# EAGLE design Interconnect_board_v1p10 (EAGLE 9.3.1)
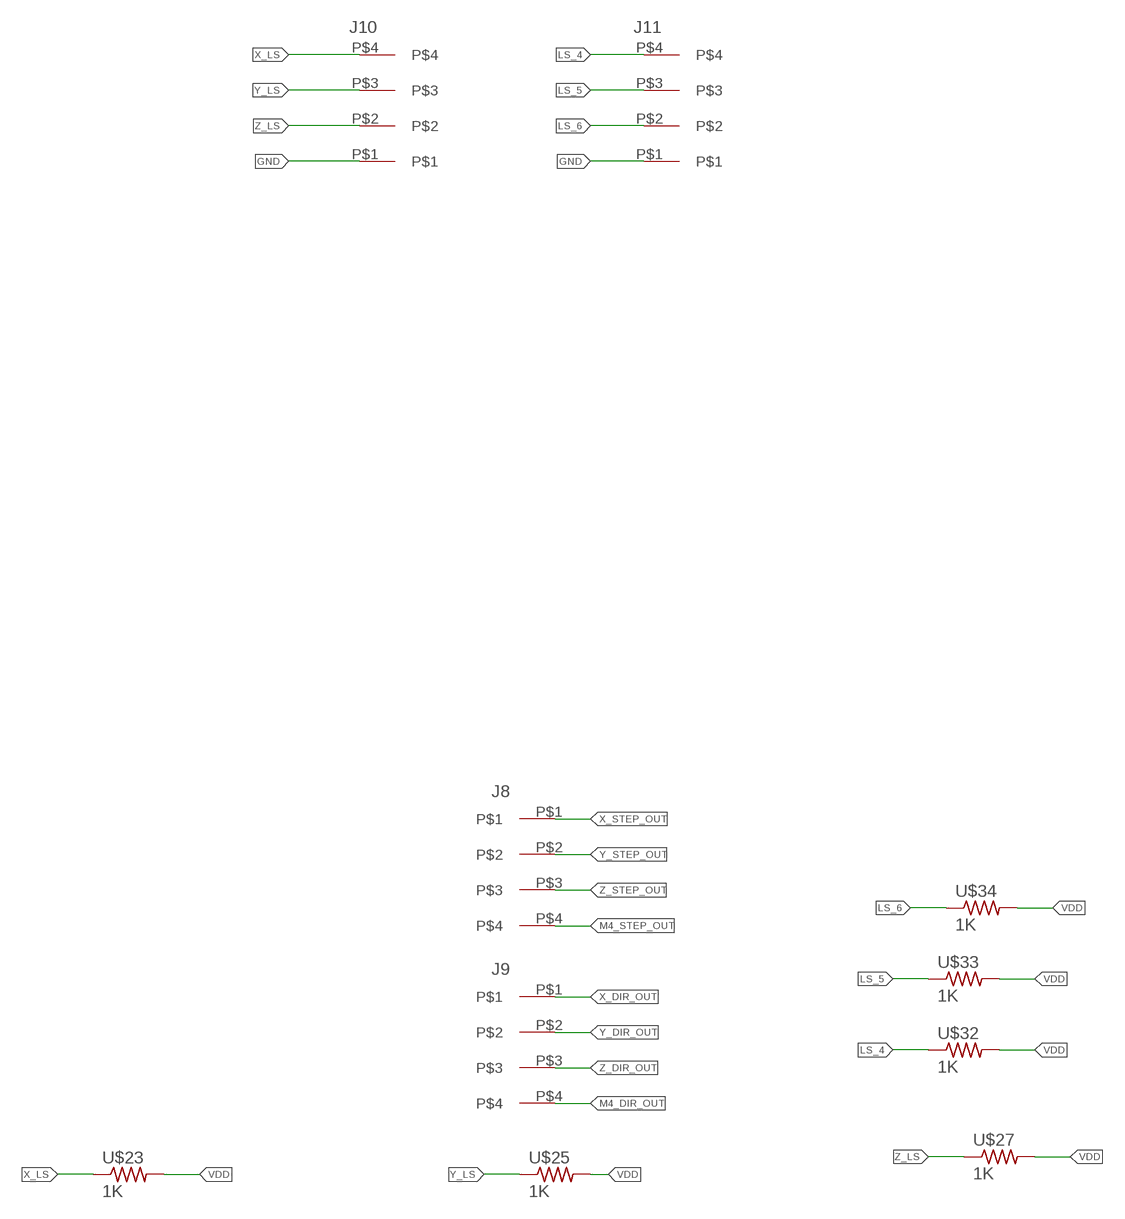
[diagram p0: schematic, sheet 1, part 1 of 2]
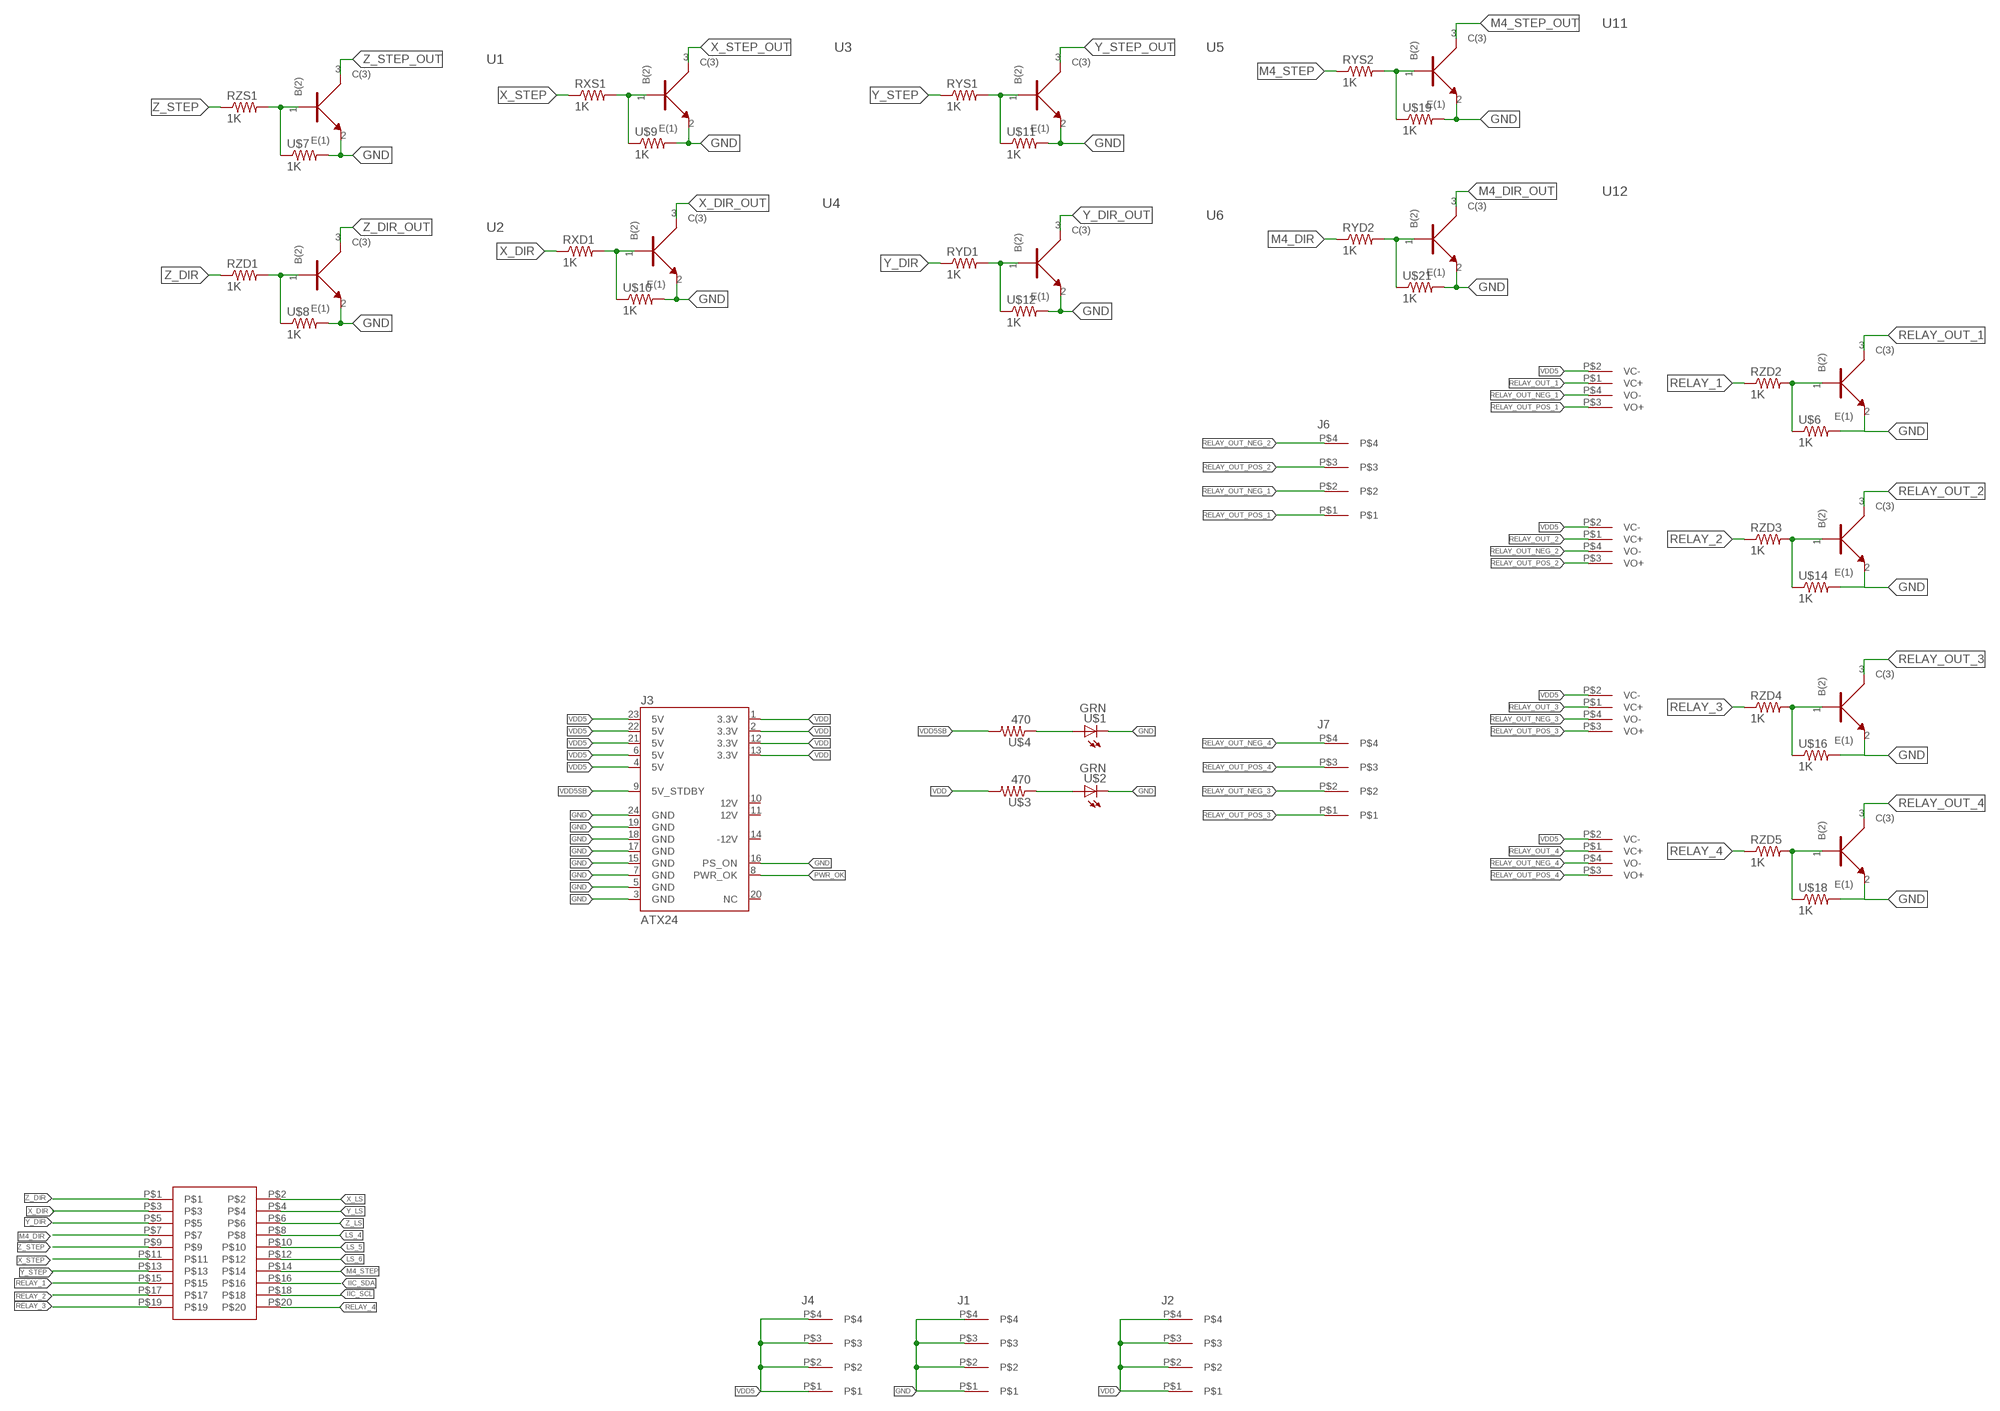
[diagram p1: schematic, sheet 1, part 2 of 2]

## Parts
J1  3.81MM_1_X_4_RT_ANGLE_PLUG_HEADER  [1X4_3.81MM_PITCH]
J2  3.81MM_1_X_4_RT_ANGLE_PLUG_HEADER  [1X4_3.81MM_PITCH]
J3  ATX24  [ATX24_STRAIGHT]
J4  3.81MM_1_X_4_RT_ANGLE_PLUG_HEADER  [1X4_3.81MM_PITCH]
J6  3.81MM_1_X_4_RT_ANGLE_PLUG_HEADER  [1X4_3.81MM_PITCH]
J7  3.81MM_1_X_4_RT_ANGLE_PLUG_HEADER  [1X4_3.81MM_PITCH]
J8  3.81MM_1_X_4_RT_ANGLE_PLUG_HEADER  [1X4_3.81MM_PITCH]
J9  3.81MM_1_X_4_RT_ANGLE_PLUG_HEADER  [1X4_3.81MM_PITCH]
J10  3.81MM_1_X_4_RT_ANGLE_PLUG_HEADER  [1X4_3.81MM_PITCH]
J11  3.81MM_1_X_4_RT_ANGLE_PLUG_HEADER  [1X4_3.81MM_PITCH]
RXD1  R_0805_1K  [R_0805_1K]
RXS1  R_0805_1K  [R_0805_1K]
RYD1  R_0805_1K  [R_0805_1K]
RYD2  R_0805_1K  [R_0805_1K]
RYS1  R_0805_1K  [R_0805_1K]
RYS2  R_0805_1K  [R_0805_1K]
RZD1  R_0805_1K  [R_0805_1K]
RZD2  R_0805_1K  [R_0805_1K]
RZD3  R_0805_1K  [R_0805_1K]
RZD4  R_0805_1K  [R_0805_1K]
RZD5  R_0805_1K  [R_0805_1K]
RZS1  R_0805_1K  [R_0805_1K]
U1  BC846BW  [SOT323]
U2  BC846BW  [SOT323]
U3  BC846BW  [SOT323]
U4  BC846BW  [SOT323]
U5  BC846BW  [SOT323]
U6  BC846BW  [SOT323]
U7  BC846BW  [SOT323]
U8  BC846BW  [SOT323]
U9  BC846BW  [SOT323]
U10  BC846BW  [SOT323]
U11  BC846BW  [SOT323]
U12  BC846BW  [SOT323]
U$1  LED_0805_GREEN  [LED_0805_GREEN]
U$2  LED_0805_GREEN  [LED_0805_GREEN]
U$3  R_0805_470  [R_0805_470]
U$4  R_0805_470  [R_0805_470]
U$5  RELAY_KYOTO_KF0604D  [RELAY_KYOTO_KF0604D]
U$6  R_0805_1K  [R_0805_1K]
U$7  R_0805_1K  [R_0805_1K]
U$8  R_0805_1K  [R_0805_1K]
U$9  R_0805_1K  [R_0805_1K]
U$10  R_0805_1K  [R_0805_1K]
U$11  R_0805_1K  [R_0805_1K]
U$12  R_0805_1K  [R_0805_1K]
U$13  RELAY_KYOTO_KF0604D  [RELAY_KYOTO_KF0604D]
U$14  R_0805_1K  [R_0805_1K]
U$15  RELAY_KYOTO_KF0604D  [RELAY_KYOTO_KF0604D]
U$16  R_0805_1K  [R_0805_1K]
U$17  RELAY_KYOTO_KF0604D  [RELAY_KYOTO_KF0604D]
U$18  R_0805_1K  [R_0805_1K]
U$19  R_0805_1K  [R_0805_1K]
U$21  R_0805_1K  [R_0805_1K]
U$23  R_0805_1K  [R_0805_1K]
U$25  R_0805_1K  [R_0805_1K]
U$26  2_X_10_HEADER_GENERIC  [2_X_10_.1_INCH]
U$27  R_0805_1K  [R_0805_1K]
U$32  R_0805_1K  [R_0805_1K]
U$33  R_0805_1K  [R_0805_1K]
U$34  R_0805_1K  [R_0805_1K]

## Nets
GND: J1.P$1 J1.P$2 J1.P$3 J1.P$4 J3.3(GND) J3.5(GND) J3.7(GND) J3.15(GND) J3.16(PS_ON) J3.17(GND) J3.18(GND) J3.19(GND) J3.24(GND) J10.P$1 J11.P$1 U1.2(E(1)) U2.2(E(1)) U3.2(E(1)) U4.2(E(1)) U5.2(E(1)) U6.2(E(1)) U7.2(E(1)) U8.2(E(1)) U9.2(E(1)) U10.2(E(1)) U11.2(E(1)) U12.2(E(1)) U$1.C U$2.C U$6.2 U$7.2 U$8.2 U$9.2 U$10.2 U$11.2 U$12.2 U$14.2 U$16.2 U$18.2 U$19.2 U$21.2
IIC_SCL: U$26.P$18
IIC_SDA: U$26.P$16
LS_4: J11.P$4 U$26.P$8 U$32.1
LS_5: J11.P$3 U$26.P$10 U$33.1
LS_6: J11.P$2 U$26.P$12 U$34.1
M4_DIR: RYD2.1 U$26.P$7
M4_DIR_OUT: J9.P$4 U12.3(C(3))
M4_STEP: RYS2.1 U$26.P$14
M4_STEP_OUT: J8.P$4 U11.3(C(3))
N$1: RXS1.2 U3.1(B(2)) U$9.1
N$2: RZD3.2 U8.1(B(2)) U$14.1
N$3: RZD1.2 U2.1(B(2)) U$8.1
N$4: U$1.A U$4.1
N$5: U$2.A U$3.1
N$6: RZD4.2 U9.1(B(2)) U$16.1
N$7: RZS1.2 U1.1(B(2)) U$7.1
N$8: RZD2.2 U7.1(B(2)) U$6.1
N$9: RYS1.2 U5.1(B(2)) U$11.1
N$10: RZD5.2 U10.1(B(2)) U$18.1
N$15: RXD1.2 U4.1(B(2)) U$10.1
N$18: RYD1.2 U6.1(B(2)) U$12.1
N$21: RYS2.2 U11.1(B(2)) U$19.1
N$22: RYD2.2 U12.1(B(2)) U$21.1
PWR_OK: J3.8(PWR_OK)
RELAY_1: RZD2.1 U$26.P$15
RELAY_2: RZD3.1 U$26.P$17
RELAY_3: RZD4.1 U$26.P$19
RELAY_4: RZD5.1 U$26.P$20
RELAY_OUT_1: U7.3(C(3)) U$5.P$1(VC+)
RELAY_OUT_2: U8.3(C(3)) U$13.P$1(VC+)
RELAY_OUT_3: U9.3(C(3)) U$15.P$1(VC+)
RELAY_OUT_4: U10.3(C(3)) U$17.P$1(VC+)
RELAY_OUT_NEG_1: J6.P$2 U$5.P$4(VO-)
RELAY_OUT_NEG_2: J6.P$4 U$13.P$4(VO-)
RELAY_OUT_NEG_3: J7.P$2 U$15.P$4(VO-)
RELAY_OUT_NEG_4: J7.P$4 U$17.P$4(VO-)
RELAY_OUT_POS_1: J6.P$1 U$5.P$3(VO+)
RELAY_OUT_POS_2: J6.P$3 U$13.P$3(VO+)
RELAY_OUT_POS_3: J7.P$1 U$15.P$3(VO+)
RELAY_OUT_POS_4: J7.P$3 U$17.P$3(VO+)
VDD: J2.P$1 J2.P$2 J2.P$3 J2.P$4 J3.1(3.3V) J3.2(3.3V) J3.12(3.3V) J3.13(3.3V) U$3.2 U$23.2 U$25.2 U$27.2 U$32.2 U$33.2 U$34.2
VDD5: J3.4(5V) J3.6(5V) J3.21(5V) J3.22(5V) J3.23(5V) J4.P$1 J4.P$2 J4.P$3 J4.P$4 U$5.P$2(VC-) U$13.P$2(VC-) U$15.P$2(VC-) U$17.P$2(VC-)
VDD5SB: J3.9(5V_STDBY) U$4.2
X_DIR: RXD1.1 U$26.P$3
X_DIR_OUT: J9.P$1 U4.3(C(3))
X_LS: J10.P$4 U$23.1 U$26.P$2
X_STEP: RXS1.1 U$26.P$11
X_STEP_OUT: J8.P$1 U3.3(C(3))
Y_DIR: RYD1.1 U$26.P$5
Y_DIR_OUT: J9.P$2 U6.3(C(3))
Y_LS: J10.P$3 U$25.1 U$26.P$4
Y_STEP: RYS1.1 U$26.P$13
Y_STEP_OUT: J8.P$2 U5.3(C(3))
Z_DIR: RZD1.1 U$26.P$1
Z_DIR_OUT: J9.P$3 U2.3(C(3))
Z_LS: J10.P$2 U$26.P$6 U$27.1
Z_STEP: RZS1.1 U$26.P$9
Z_STEP_OUT: J8.P$3 U1.3(C(3))
Unconnected: J3.10(12V) J3.11(12V) J3.14(-12V) J3.20(NC)

## Library data of the parts
J1 J2 J4 J6-J11 = 3D_MIG_Controller:3.81MM_1_X_4_RT_ANGLE_PLUG_HEADER
J3 = 3D_MIG_Controller:ATX24: ATX24 Pin Power Supply Connector - Right Angle PTH Mount This is a good connector for connecting a computer power supply to a PCB. It's massive, but provides many amps of power at 5V and 12V. SparkFun Products: SparkFun Benchtop Power Board Kit <https://www.sparkfun.com/products/12867> SparkFun Power Driver Shield Kit <https://www.sparkfun.com/products/10618>
RXD1 RXS1 RYD1 RYD2 RYS1 RYS2 RZD1-RZD5 RZS1 U$6-U$12 U$14 U$16 U$18 U$19 U$21 U$23 U$25 U$27 U$32-U$34 = 3D_MIG_Controller:R_0805_1K
U1-U12 = 3D_MIG_Controller:BC846BW; MANUFACTURER_PART_NUMBER: BC846BW; VENDOR: Nexperia
U$1 U$2 = 3D_MIG_Controller:LED_0805_GREEN
U$3 U$4 = 3D_MIG_Controller:R_0805_470
U$5 U$13 U$15 U$17 = 3D_MIG_Controller:RELAY_KYOTO_KF0604D
U$26 = 3D_MIG_Controller:2_X_10_HEADER_GENERIC

## Board
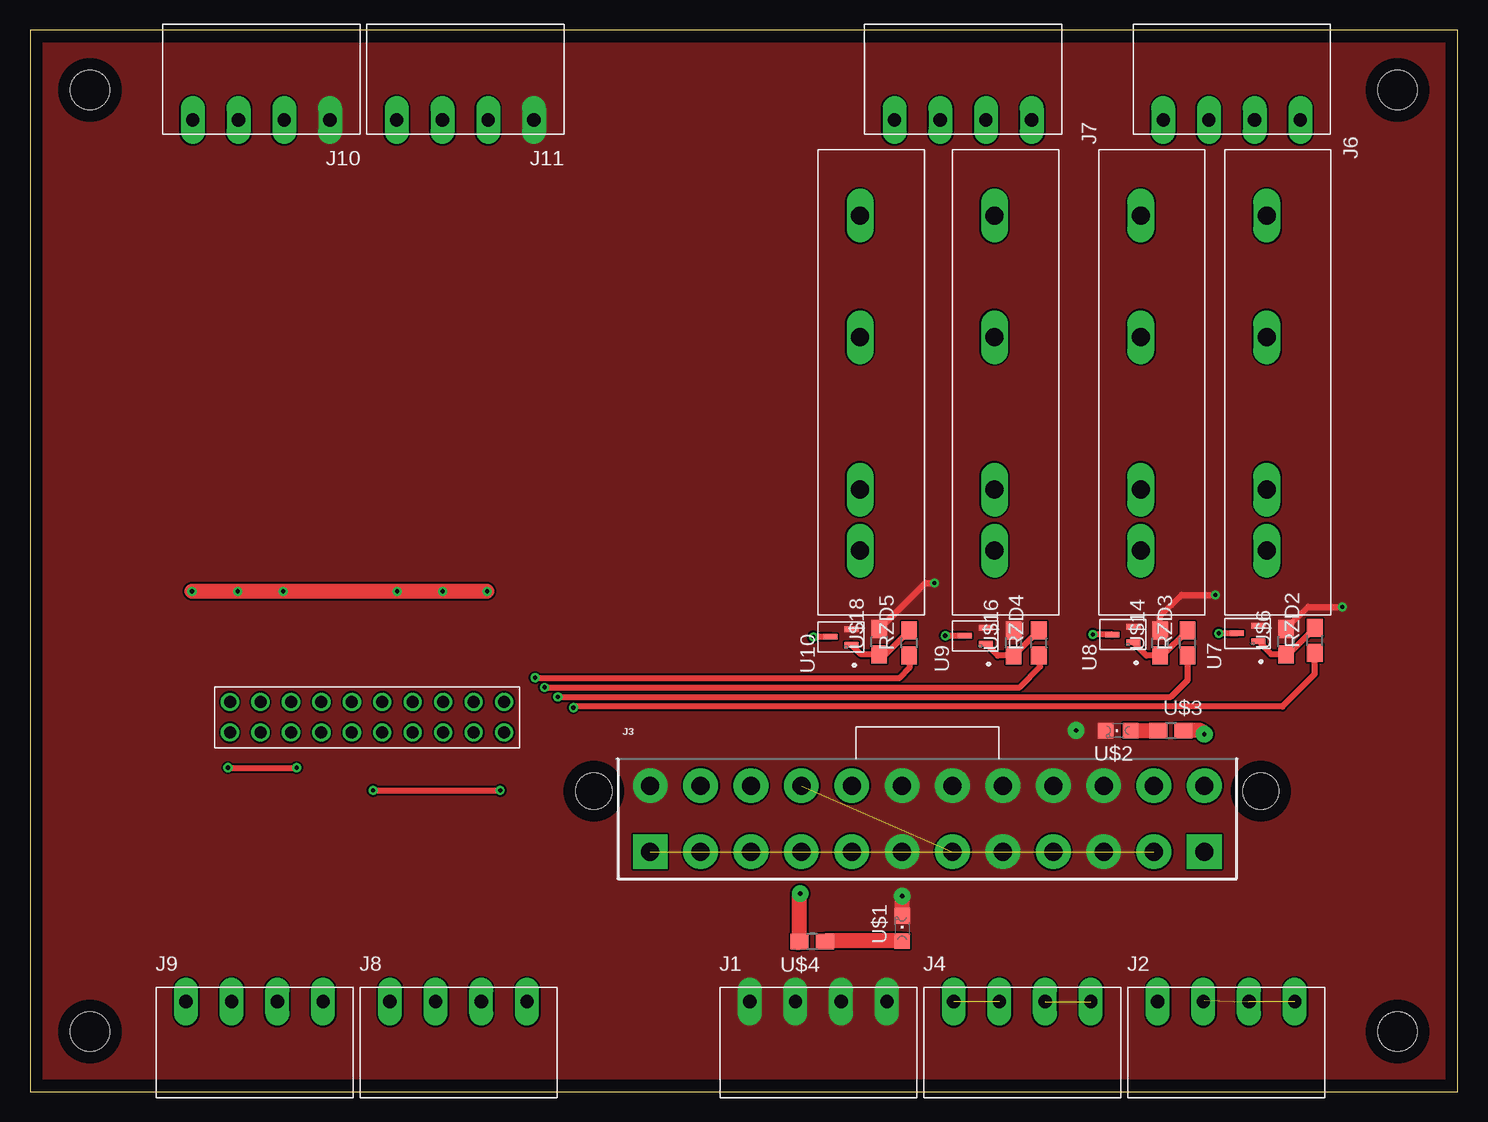
[diagram p2: board, top side]
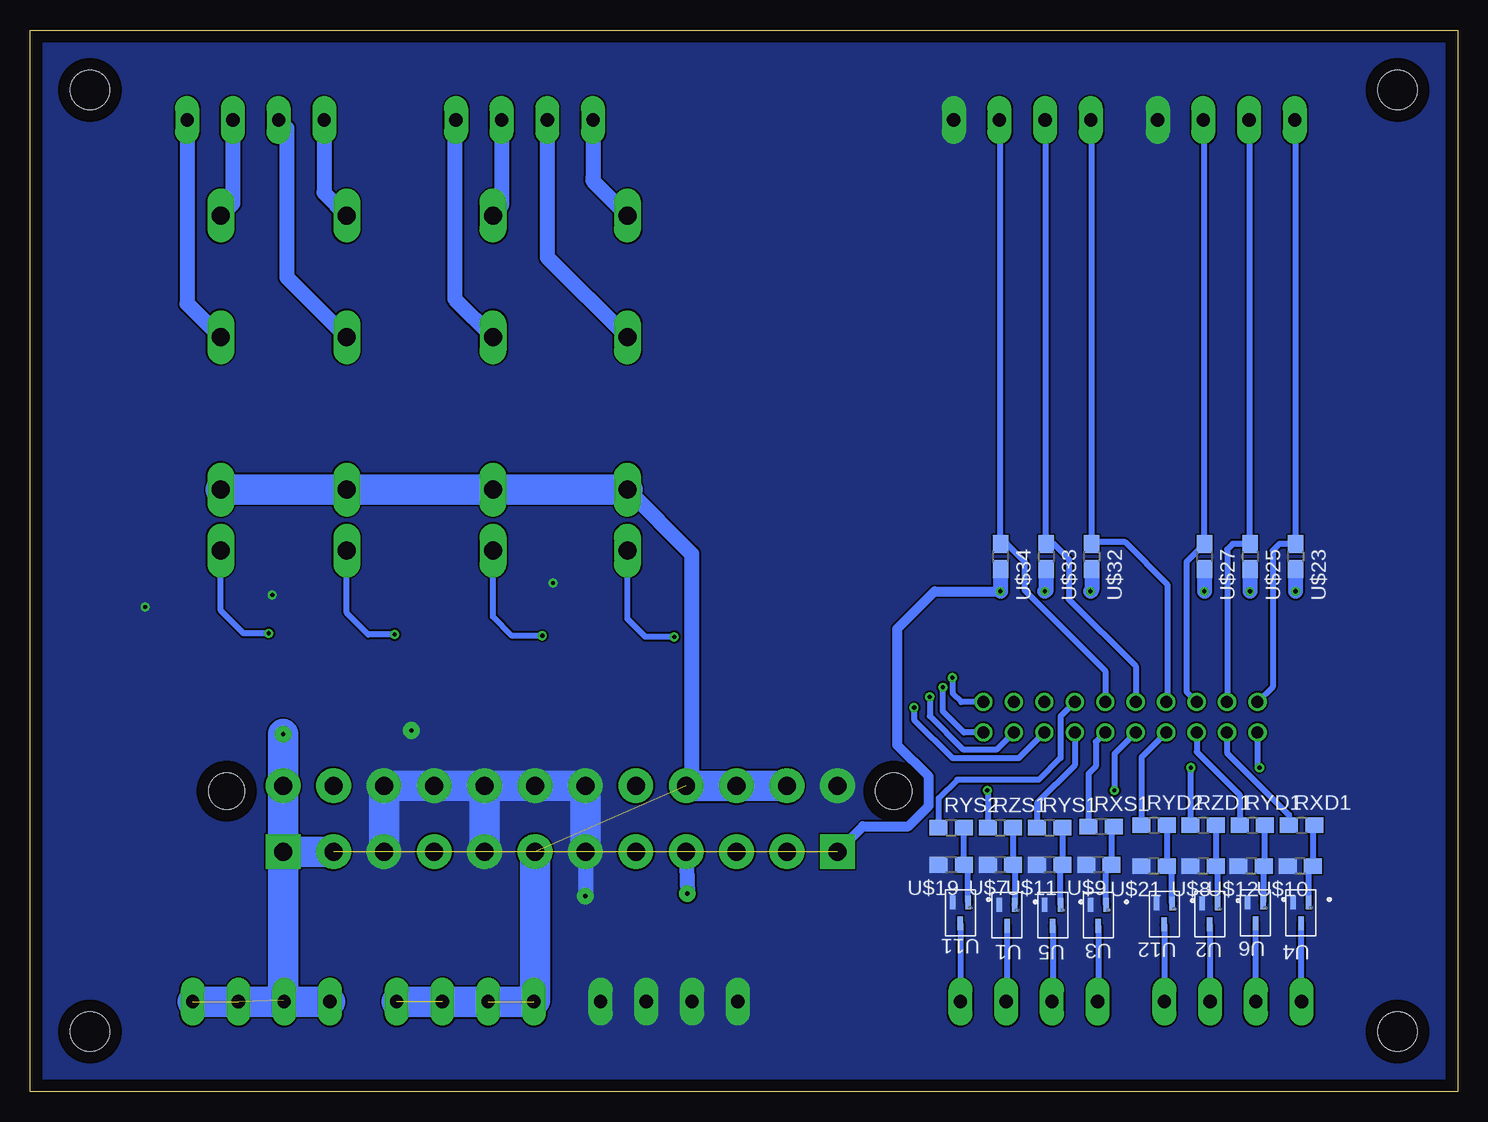
[diagram p3: board, bottom side, seen from below]

Size 119 x 88.5 mm. Coordinates in mm from the lower left corner, seen from the top.
Outline: 0,0 119,0 119,88.5 0,88.5 0,0
Copper layers (1*16): Top 0.035mm / dielectric 1.5mm / Bottom 0.035mm
Design rules "default": minimum track width 6mil, minimum drill 0.35mm, track to track 6mil, track to pad 6mil, pad to pad 6mil, via to via 6mil, smd to smd 6mil, copper to edge 40mil, drill to drill 6mil, minimum pad ring 10mil, minimum via ring 8mil, stop-mask expansion 4mil, vias tented up to drill 0mil, thermal gap 10mil
Holes 3.3 mm at 5,83.5 5,5 114,5 114,83.5

### Footprints (pad centres in the part's own frame; a part is rotated, then mirrored left to right if it is on the bottom)
1X4_3.81MM_PITCH = drill 1.1 pad 2 long: P$1 0,0; P$2 3.81,0; P$3 7.62,0; P$4 11.43,0
ATX24_STRAIGHT = drill 1.5 pad 2.9 square: 1 23.1,-5.5; 12 -23.1,-5.5 | drill 1.5 pad 2.9: 2 18.9,-5.5; 3 14.7,-5.5; 4 10.5,-5.5; 5 6.3,-5.5; 6 2.1,-5.5; 7 -2.1,-5.5; 8 -6.3,-5.5; 9 -10.5,-5.5; 10 -14.7,-5.5; 11 -18.9,-5.5; 13 23.1,0; 14 18.9,0; 15 14.7,0; 16 10.5,0; 17 6.3,0; 18 2.1,0; 19 -2.1,0; 20 -6.3,0; 21 -10.5,0; 22 -14.7,0; 23 -18.9,0; 24 -23.1,0 | hole 3: -27.8,-0.46; 27.8,-0.46
R_0805_1K = smd 1.5 x 1.3: 1 -1.052,0; 2 1.052,0
SOT323 = smd 0.457 x 1.168: 1 -0.65,-0.876; 2 0.65,-0.876; 3 0,0.876
LED_0805_GREEN = smd 1.3 x 1.3: A 0,-1.05; C 0,1.05
R_0805_470 = smd 1.5 x 1.3: 1 -1.052,0; 2 1.052,0
RELAY_KYOTO_KF0604D = drill 1.5 long: P$1 0,0; P$2 -5.08,0; P$3 -17.78,0; P$4 -27.94,0
2_X_10_.1_INCH = drill 1: P$1 -11.43,-1.27; P$2 -11.43,1.27; P$3 -8.89,-1.27; P$4 -8.89,1.27; P$5 -6.35,-1.27; P$6 -6.35,1.27; P$7 -3.81,-1.27; P$8 -3.81,1.27; P$9 -1.27,-1.27; P$10 -1.27,1.27; P$11 1.27,-1.27; P$12 1.27,1.27; P$13 3.81,-1.27; P$14 3.81,1.27; P$15 6.35,-1.27; P$16 6.35,1.27; P$17 8.89,-1.27; P$18 8.89,1.27; P$19 11.43,-1.27; P$20 11.43,1.27

### Placement (x,y rotation side)
J1  60,7.5 0 top
J2  94,7.5 0 top
J3  74.8,25.5 0 top
J4  77,7.5 0 top
J6  105.9,81 180 top
J7  83.5,81 180 top
J8  30,7.5 0 top
J9  13,7.5 0 top
J10  25,81 180 top
J11  42,81 180 top
RXD1  13,22.2 0 bottom
RXS1  29.7,22.1 0 bottom
RYD1  17.1,22.2 0 bottom
RYD2  25.3,22.2 0 bottom
RYS1  34,22 0 bottom
RYS2  42.2,22 0 bottom
RZD1  21.2,22.2 0 bottom
RZD2  107.1,37.6 90 top
RZD3  96.5,37.4 90 top
RZD4  84.1,37.4 90 top
RZD5  73.3,37.4 90 top
RZS1  38.1,22 0 bottom
U1  37.55,14.7 180 bottom
U2  20.65,14.8 180 bottom
U3  29.95,14.7 180 bottom
U4  13.05,14.9 180 bottom
U5  33.75,14.7 180 bottom
U6  16.85,14.9 180 bottom
U7  101.5,38.2 90 top
U8  91.1,38.1 90 top
U9  78.8,38 90 top
U10  67.6,37.9 90 top
U11  41.45,14.9 180 bottom
U12  24.45,14.8 180 bottom
U$1  72.7,13.6 0 top
U$2  90.7,30.1 90 top
U$3  95.1,30.1 0 top
U$4  65.2,12.5 180 top
U$5  103.1,45.1 270 top
U$6  104.7,37.5 90 top
U$7  38.1,18.9 180 bottom
U$8  21.2,18.8 180 bottom
U$9  29.9,18.9 180 bottom
U$10  13.1,18.8 180 bottom
U$11  34,18.9 180 bottom
U$12  17.2,18.8 180 bottom
U$13  92.6,45.1 270 top
U$14  94.2,37.4 90 top
U$15  80.4,45.1 270 top
U$16  82,37.4 90 top
U$17  69.2,45.1 270 top
U$18  70.8,37.5 90 top
U$19  42.2,18.9 180 bottom
U$21  25.3,18.8 180 bottom
U$23  13.5,44.6 270 bottom
U$25  17.3,44.6 270 bottom
U$26  28.1,31.2 0 top
U$27  21.1,44.6 270 bottom
U$32  30.5,44.6 270 bottom
U$33  34.3,44.6 270 bottom
U$34  38.1,44.6 270 bottom

### Tracks (layer width: path | path; a pad name or v marks a point on that pad's centre or on a via)
GND  (via drill 0.35, 0.35 pad 1.4)
  Top 0.508: U$18.2 74.65,42.4 v75.4,42.4 | U$6.2 106.55,40.4 v109.4,40.4 | U$14.2 94.2,39.6 96,41.4 v98.8,41.4
  Top 1.27: v72.7,16.3 U$1.C
  Bottom 1.27: J3.7 v72.7,16.3 | J3.15 80.2,25.5
  Bottom 2.54: J3.3 J3.15 J3.16 J3.17 | J3.5 J3.17 | J3.7 J3.19 J3.18 J3.17
  other vias: 87.2,30.1
  pour Top (no thermals): 0,88.5 0,0 119,0 119,73.9 119,88.5
  pour Bottom (no thermals): 0,88.5 0,0 119,0 119,88.5
LS_4
  Bottom 0.508: U$26.P$8 24.19,32.57 24.19,42.29 27.7,45.8 30.47,45.8 30.47,45.68 U$32.1 30.5,80.93 J11.P$4
LS_5
  Bottom 0.508: 34.28,45.67 U$33.1 | U$33.1 33.65,45.65 32.4,44.4 32.4,41.04 26.83,35.47 U$26.P$10 | U$33.1 34.3,80.92 J11.P$3
LS_6
  Bottom 0.508: 38.09,45.66 U$34.1 | U$34.1 37.55,45.65 36.1,44.2 36.1,41.8 29.37,35.07 U$26.P$12 | U$34.1 38.1,80.91 J11.P$2
M4_DIR
  Bottom 0.508: U$26.P$7 26.35,27.87 RYD2.1
M4_DIR_OUT
  Bottom 0.508: U12.3 24.45,7.52 J9.P$4
M4_STEP
  Bottom 0.508: U$26.P$14 33.1,31.28 33.1,27.8 34.9,26 41.7,26 43.25,24.45 RYS2.1
M4_STEP_OUT
  Bottom 0.508: U11.3 41.45,7.52 J8.P$4
N$1
  Bottom 0.508: U3.1 29.3,18.45 U$9.1 28.85,21.9 RXS1.2
N$2
  Top 0.508: RZD3.2 94.39,36.35 U$14.1 93.08,36.35 U8.1
N$3
  Bottom 0.508: U2.1 20,18.65 U$8.1 RZD1.2
N$4
  Top 1.27: U$1.A 66.3,12.55 U$4.1
N$5
  Top 1.27: U$2.A U$3.1
N$6
  Top 0.508: RZD4.2 U$16.1 80.68,36.35 U9.1
N$7
  Bottom 0.508: RZS1.2 U$7.1 36.9,18.75 U1.1
N$8
  Top 0.508: RZD2.2 104.89,36.45 U$6.1 103.48,36.45 U7.1
N$9
  Bottom 0.508: RYS1.2 U$11.1 33.1,18.75 U5.1
N$10
  Top 0.508: RZD5.2 71.3,36.45 U$18.1 69.28,36.45 U10.1
N$15
  Bottom 0.508: U4.1 12.4,18.45 U$10.1 12.05,22.1 RXD1.2
N$18
  Bottom 0.508: U6.1 16.15,15.83 U$12.1 16.05,18.9 RYD1.2
N$21
  Bottom 0.508: U11.1 40.8,18.55 U$19.1 RYS2.2
N$22
  Bottom 0.508: U12.1 23.8,18.35 U$21.1 RYD2.2
RELAY_1  (via drill 0.35)
  Top 0.508: v45.3,32 45.4,32.1 104.4,32.1 107.1,34.8 RZD2.1
  Bottom 0.508: v45.3,32 45.3,31 42.1,27.8 36.58,27.8 U$26.P$15
RELAY_2  (via drill 0.35)
  Top 0.508: v44,32.9 95.1,32.9 96.5,34.3 RZD3.1
  Bottom 0.508: v44,32.9 44,31.3 41.23,28.53 38.39,28.53 U$26.P$17
RELAY_3  (via drill 0.35)
  Top 0.508: RZD4.1 84.2,36.25 84.2,35.4 82.5,33.7 v42.9,33.7
  Bottom 0.508: v42.9,33.7 42.93,33.67 42.93,31.73 41.13,29.93 U$26.P$19
RELAY_4  (via drill 0.35)
  Top 0.508: v42.1,34.5 72.5,34.5 73.3,35.3 RZD5.1
  Bottom 0.508: v42.1,34.5 42.1,33.2 41.37,32.47 U$26.P$20
RELAY_OUT_1  (via drill 0.35)
  Top 0.508: U7.3 v99.1,38.2
  Bottom 0.508: v99.1,38.2 101.2,38.2 103.1,40.1 U$5.P$1
RELAY_OUT_2  (via drill 0.35)
  Top 0.508: U8.3 v88.6,38.1
  Bottom 0.508: v88.6,38.1 90.8,38.1 92.6,39.9 U$13.P$1
RELAY_OUT_3  (via drill 0.35)
  Top 0.508: U9.3 v76.3,38
  Bottom 0.508: v76.3,38 78.8,38 80.4,39.6 U$15.P$1
RELAY_OUT_4  (via drill 0.35)
  Top 0.508: U10.3 v65.3,37.9
  Bottom 0.508: v65.3,37.9 67.7,37.9 69.2,39.4 U$17.P$1
RELAY_OUT_NEG_1
  Bottom 1.27: J6.P$2 102.1,74.04 U$5.P$4
RELAY_OUT_NEG_2
  Bottom 1.27: J6.P$4 94.5,80.97 94.5,74.94 U$13.P$4
RELAY_OUT_NEG_3
  Bottom 1.27: J7.P$2 79.69,73.85 80.4,73.14 U$15.P$4
RELAY_OUT_NEG_4
  Bottom 1.27: J7.P$4 72.07,76.16 72.1,76.13 72.1,75.94 U$17.P$4
RELAY_OUT_POS_1
  Bottom 1.27: U$5.P$3 105.9,65.68 J6.P$1
RELAY_OUT_POS_2
  Bottom 1.27: U$13.P$3 97.6,67.88 97.6,80.32 J6.P$3
RELAY_OUT_POS_3
  Bottom 1.27: J7.P$1 83.6,80.7 83.6,66.08 U$15.P$3
RELAY_OUT_POS_4
  Bottom 1.27: J7.P$3 75.88,69.56 U$17.P$3
VDD  (via drill 0.35, 0.35 pad 1.4)  (3 unrouted)
  Top 1.27: v97.9,29.8 97.6,30.1 U$3.2 | v38.1,41.7 v34.4,41.7 v30.6,41.7 v21.1,41.7 v17.3,41.7 v13.5,41.7
  Bottom 0.813: J3.12 49.58,22.12 45.79,22.12 44.08,23.83 44.08,26.25 46.7,28.87 46.7,38.6 43.6,41.7 v38.1,41.7
  Bottom 1.27: U$34.2 v38.1,41.7 | v13.5,41.7 U$23.2 | U$25.2 v17.3,41.7 | U$27.2 v21.1,41.7 | U$32.2 30.5,41.8 v30.6,41.7 | U$33.2 34.3,41.8 v34.4,41.7
  Bottom 2.54: J3.1 J3.13 v97.9,29.8 | J3.2 J3.1 | J3.1 97.9,7.59 J2.P$2 | J2.P$1 J2.P$4
VDD5  (4 unrouted)
  Bottom 1.27: J3.21 63.83,25.97 63.83,44.81 U$17.P$2
  Bottom 2.54: J3.21 J3.22 J3.23 | U$17.P$2 U$15.P$2 U$13.P$2 U$5.P$2 | J4.P$4 J4.P$1 76.9,7.6 J3.6
VDD5SB  (via drill 0.35 pad 1.4)
  Top 1.27: 64.05,12.4 U$4.2 64.15,16.45 v64.2,16.5
  Bottom 1.27: J3.9 v64.2,16.5
X_DIR
  Bottom 0.508: U$26.P$3 19.21,28.23 14.05,23.07 RXD1.1
X_DIR_OUT
  Bottom 0.508: U4.3 13.05,7.55 J9.P$1
X_LS
  Bottom 0.508: 13.37,45.78 U$23.1 | U$23.1 14.85,45.65 15.4,45.1 15.4,33.74 U$26.P$2 | U$23.1 13.5,80.93 J10.P$4
X_STEP
  Bottom 0.508: U$26.P$11 30.15,29.15 30.15,27.1 30.75,26.5 RXS1.1
X_STEP_OUT
  Bottom 0.508: U3.3 29.95,7.55 J8.P$1
Y_DIR
  Bottom 0.508: U$26.P$5 21.75,28.33 18.15,24.73 RYD1.1
Y_DIR_OUT
  Bottom 0.508: U6.3 16.85,7.54 J9.P$2
Y_LS
  Bottom 0.508: 17.28,45.67 U$25.1 | U$25.1 18.75,45.65 19.2,45.2 U$26.P$4 | U$25.1 17.3,80.92 J10.P$3
Y_STEP
  Bottom 0.508: U$26.P$13 31.91,27.19 35.05,24.05 RYS1.1
Y_STEP_OUT
  Bottom 0.508: U5.3 33.75,7.56 J8.P$2
Z_DIR  (via drill 0.35)
  Top 0.508: v16.5,27 v22.23,27
  Bottom 0.508: U$26.P$1 16.67,27.17 v16.5,27 | v22.23,27 22.31,26.92 22.31,26.76 22.25,26.7 RZD1.1
Z_DIR_OUT
  Bottom 0.508: U2.3 20.65,7.53 J9.P$3
Z_LS
  Bottom 0.508: 21.09,45.66 U$27.1 | U$27.1 22.6,44.15 22.6,33.32 U$26.P$6 | U$27.1 21.1,80.91 J10.P$2
Z_STEP  (via drill 0.35)
  Top 0.508: v28.6,25.1 v39.2,25.1
  Bottom 0.508: U$26.P$9 28.6,28.16 v28.6,25.1 | v39.2,25.1 39.15,25.05 RZS1.1
Z_STEP_OUT
  Bottom 0.508: U1.3 37.55,7.57 J8.P$3